# Altium schematic sheet PowerBoard.SchDoc
size A4
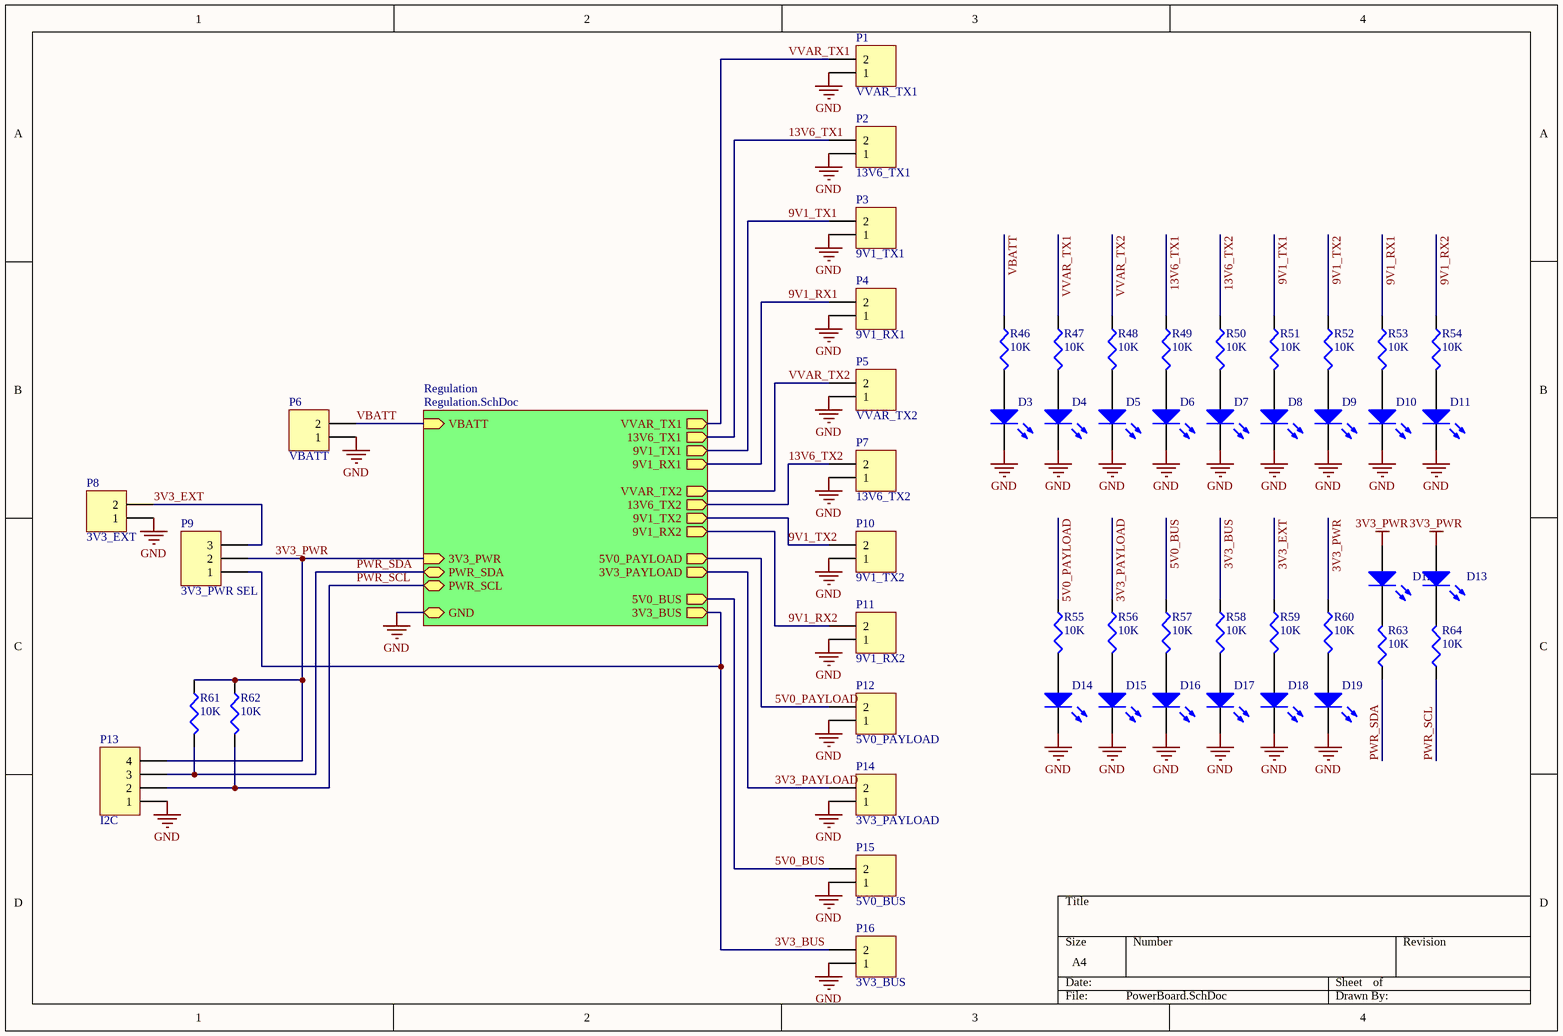
[diagram p0: PowerBoard.SchDoc]

## Parts
D3  LED0  [R0805M]  (value not drawn)
D4  LED0  [R0805M]  (value not drawn)
D5  LED0  [R0805M]  (value not drawn)
D6  LED0  [R0805M]  (value not drawn)
D7  LED0  [R0805M]  (value not drawn)
D8  LED0  [R0805M]  (value not drawn)
D9  LED0  [R0805M]  (value not drawn)
D10  LED0  [R0805M]  (value not drawn)
D11  LED0  [R0805M]  (value not drawn)
D12  LED0  [R0805M]  (value not drawn)
D13  LED0  [R0805M]  (value not drawn)
D14  LED0  [R0805M]  (value not drawn)
D15  LED0  [R0805M]  (value not drawn)
D16  LED0  [R0805M]  (value not drawn)
D17  LED0  [R0805M]  (value not drawn)
D18  LED0  [R0805M]  (value not drawn)
D19  LED0  [R0805M]  (value not drawn)
P1  VVAR_TX1  [200MIL TERMINAL]
P2  13V6_TX1  [200MIL TERMINAL]
P3  9V1_TX1  [200MIL TERMINAL]
P4  9V1_RX1  [200MIL TERMINAL]
P5  VVAR_TX2  [200MIL TERMINAL]
P6  VBATT  [200MIL TERMINAL]
P7  13V6_TX2  [200MIL TERMINAL]
P8  3V3_EXT  [200MIL TERMINAL]
P9  3V3_PWR SEL  [HDR1X3]
P10  9V1_TX2  [200MIL TERMINAL]
P11  9V1_RX2  [200MIL TERMINAL]
P12  5V0_PAYLOAD  [200MIL TERMINAL]
P13  I2C  [HDR1X4]
P14  3V3_PAYLOAD  [200MIL TERMINAL]
P15  5V0_BUS  [200MIL TERMINAL]
P16  3V3_BUS  [200MIL TERMINAL]
R46  value 10K  [R0402M]
R47  value 10K  [R0402M]
R48  value 10K  [R0402M]
R49  value 10K  [R0402M]
R50  value 10K  [R0402M]
R51  value 10K  [R0402M]
R52  value 10K  [R0402M]
R53  value 10K  [R0402M]
R54  value 10K  [R0402M]
R55  value 10K  [R0402M]
R56  value 10K  [R0402M]
R57  value 10K  [R0402M]
R58  value 10K  [R0402M]
R59  value 10K  [R0402M]
R60  value 10K  [R0402M]
R61  value 10K  [R0402M]
R62  value 10K  [R0402M]
R63  value 10K  [R0402M]
R64  value 10K  [R0402M]

## Sub-sheets
Regulation = Regulation.SchDoc: VBATT (in), GND, PWR_SDA (bidir), PWR_SCL (bidir), 3V3_PWR (in), 3V3_BUS (out), 3V3_PAYLOAD (out), 5V0_BUS (out), 5V0_PAYLOAD (out), 9V1_RX1 (out), 9V1_RX2 (out), 9V1_TX1 (out), 9V1_TX2 (out), 13V6_TX1 (out), 13V6_TX2 (out), VVAR_TX1 (out), VVAR_TX2 (out)

## Nets
3V3_PWR: D12.1(A) D13.1(A) P9.2 P13.4 R60.1 R61.1 R62.1 ; sheet Regulation/3V3_PWR
GND: D3.2(K) D4.2(K) D5.2(K) D6.2(K) D7.2(K) D8.2(K) D9.2(K) D10.2(K) D11.2(K) D14.2(K) D15.2(K) D16.2(K) D17.2(K) D18.2(K) D19.2(K) P1.1 P2.1 P3.1 P4.1 P5.1 P6.1 P7.1 P8.1 P10.1 P11.1 P12.1 P13.1 P14.1 P15.1 P16.1 ; sheet Regulation/GND
3V3_BUS: P9.1 P16.2 R58.1 ; sheet Regulation/3V3_BUS
3V3_EXT: P8.2 P9.3 R59.1
3V3_PAYLOAD: P14.2 R56.1 ; sheet Regulation/3V3_PAYLOAD
5V0_BUS: P15.2 R57.1 ; sheet Regulation/5V0_BUS
5V0_PAYLOAD: P12.2 R55.1 ; sheet Regulation/5V0_PAYLOAD
9V1_RX1: P4.2 R53.1 ; sheet Regulation/9V1_RX1
9V1_RX2: P11.2 R54.1 ; sheet Regulation/9V1_RX2
9V1_TX1: P3.2 R51.1 ; sheet Regulation/9V1_TX1
9V1_TX2: P10.2 R52.1 ; sheet Regulation/9V1_TX2
13V6_TX1: P2.2 R49.1 ; sheet Regulation/13V6_TX1
13V6_TX2: P7.2 R50.1 ; sheet Regulation/13V6_TX2
PWR_SCL: P13.2 R62.2 R64.1 ; sheet Regulation/PWR_SCL
PWR_SDA: P13.3 R61.2 R63.1 ; sheet Regulation/PWR_SDA
VBATT: P6.2 R46.1 ; sheet Regulation/VBATT
VVAR_TX1: P1.2 R47.1 ; sheet Regulation/VVAR_TX1
VVAR_TX2: P5.2 R48.1 ; sheet Regulation/VVAR_TX2
NetD3_1: D3.1(A) R46.2
NetD4_1: D4.1(A) R47.2
NetD5_1: D5.1(A) R48.2
NetD6_1: D6.1(A) R49.2
NetD7_1: D7.1(A) R50.2
NetD8_1: D8.1(A) R51.2
NetD9_1: D9.1(A) R52.2
NetD10_1: D10.1(A) R53.2
NetD11_1: D11.1(A) R54.2
NetD12_2: D12.2(K) R63.2
NetD13_2: D13.2(K) R64.2
NetD14_1: D14.1(A) R55.2
NetD15_1: D15.1(A) R56.2
NetD16_1: D16.1(A) R57.2
NetD17_1: D17.1(A) R58.2
NetD18_1: D18.1(A) R59.2
NetD19_1: D19.1(A) R60.2

## Library data of the parts
D3-D19 = LED0: Typical INFRARED GaAs LED; Published: 8-Jun-2000; LatestRevisionDate: 08-Jul-2005; LatestRevisionNote: Mech Layer 1 removed.; PackageReference: LED-0; Publisher: Altium Limited; PackageDescription: LED; 2 Leads
P1-P8 P10-P12 P14-P16 = Header 2: Header, 2-Pin; LatestRevisionDate: 17-Jul-2002; LatestRevisionNote: Re-released for DXP Platform.; Publisher: Altium Limited
P9 = Header 3: Header, 3-Pin; LatestRevisionDate: 17-Jul-2002; LatestRevisionNote: Re-released for DXP Platform.; Publisher: Altium Limited
P13 = Header 4: Header, 4-Pin; LatestRevisionDate: 17-Jul-2002; LatestRevisionNote: Re-released for DXP Platform.; Publisher: Altium Limited
R46-R64 = Res3: Resistor; Published: 8-Jun-2000; LatestRevisionDate: 29-May-2009; LatestRevisionNote: IPC-7351 Footprint Added.; PackageReference: J1-0603; Publisher: Altium Limited; PackageDescription: Chip Resistor